# Altium project DRV8874.PrjPcb
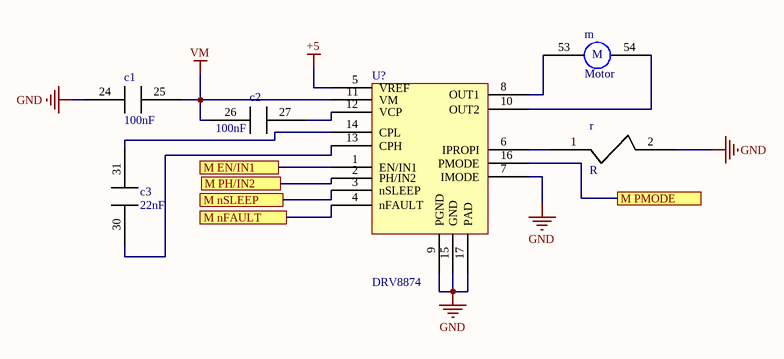
[diagram p0: Sheet1.SchDoc]
1 sheet, 6 parts. Net scope: flat (ports and power ports of the same name join across sheets).
Board file: PCB1.PcbDoc

## Sheet Sheet1.SchDoc
size A; SheetNumber: 1; SheetTotal: 1

### Parts
c1  100nF  [Capacitor0602]
c2  100nF  [Capacitor0602]
c3  22nF  [Capacitor0602]
m  Motor  [Motor]
r  R  [Resistor0603]
U?  DRV8874  [DRV8874]

### Ports
M EN/IN1, M nFAULT, M nSLEEP, M PH/IN2, M PMODE

### Nets
+5: U?.5(VREF)
GND: c1.24 r.2 U?.7(IMODE) U?.9(PGND) U?.15(GND) U?.17(PAD)
VM: c1.25 c2.26 U?.11(VM)
Netc2_27: c2.27 U?.12(VCP)
Netc3_30: c3.30 U?.13(CPH)
Netc3_31: c3.31 U?.14(CPL)
Netm_53: m.53 U?.8(OUT1)
Netm_54: m.54 U?.10(OUT2)
Netr_1: r.1 U?.6(IPROPI)
NetU?_1: U?.1(EN/IN1) ; port M EN/IN1
NetU?_2: U?.2(PH/IN2) ; port M PH/IN2
NetU?_3: U?.3(nSLEEP) ; port M nSLEEP
NetU?_4: U?.4(nFAULT) ; port M nFAULT
NetU?_16: U?.16(PMODE) ; port M PMODE

### Notes on the sheet
- (in symbol Motor) M

### Library data of the parts
c1 c2 = Capacitor0603
c3 = Capacitor0603 22n
U? = DRV8874: Manufacturer: Texas Instruments; Supplier: LCSC